# EAGLE design hello_marco (EAGLE 7.2.0)
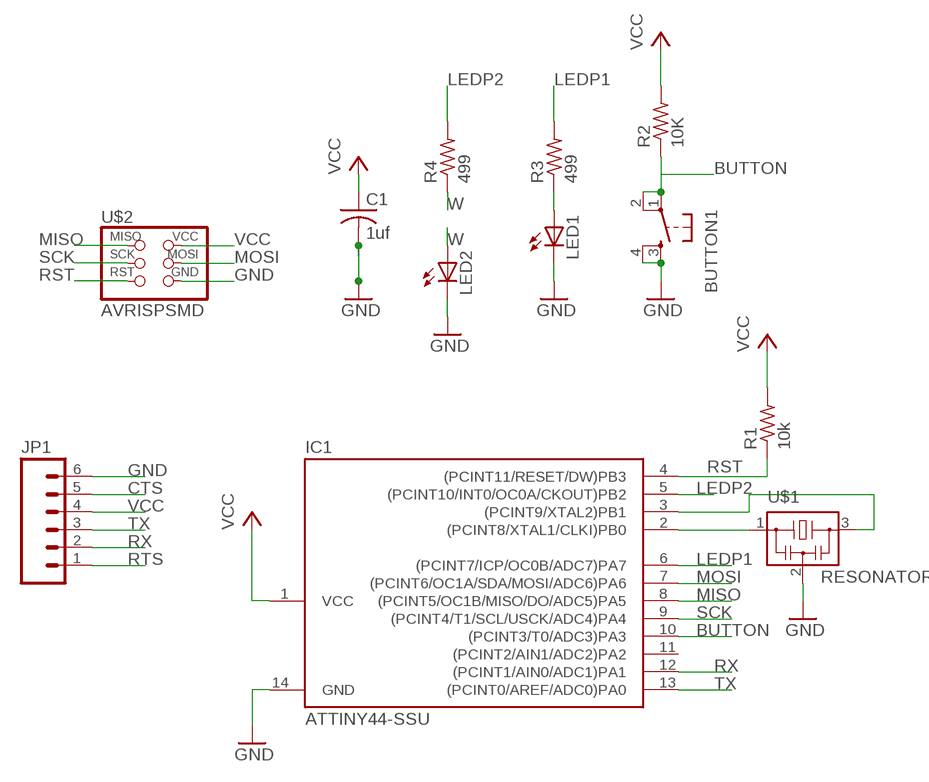
[diagram p0: schematic, sheet 1]

## Parts
BUTTON1  6MM_SWITCH6MM_SWITCH  [6MM_SWITCH]
C1  1uf  C-USC1206  [C1206]
IC1  ATTINY44-SSU  [SOIC14]
JP1  M06SMD  [1X06-SMD]
LED1  LED1206  [1206]
LED2  LED1206  [1206]
R1  10k  R-US_R1206  [R1206]
R2  10K  RESISTOR1206  [1206]
R3  499  RESISTOR1206  [1206]
R4  499  RESISTOR1206  [1206]
U$1  RESONATOR  [EFOBM]
U$2  AVRISPSMD  [2X03SMD]

## Nets
BUTTON: IC1.10((PCINT3/T0/ADC3)PA3)
CTS: JP1.5
GND: BUTTON1.3(S) BUTTON1.4(S1) C1.2 IC1.14(GND) JP1.6 LED1.2(C) LED2.2(C) U$1.2 U$2.6(GND)
LEDP1: IC1.6((PCINT7/ICP/OC0B/ADC7)PA7) R3.2
LEDP2: IC1.5((PCINT10/INT0/OC0A/CKOUT)PB2) R4.2
MISO: IC1.8((PCINT5/OC1B/MISO/DO/ADC5)PA5) U$2.1(MISO)
MOSI: IC1.7((PCINT6/OC1A/SDA/MOSI/ADC6)PA6) U$2.4(MOSI)
N$1: IC1.2((PCINT8/XTAL1/CLKI)PB0) U$1.1
N$2: IC1.3((PCINT9/XTAL2)PB1) U$1.3
N$3: LED1.1(A) R3.1
N$4: BUTTON1.1(P) BUTTON1.2(P1) R2.1
RST: IC1.4((PCINT11/RESET/DW)PB3) R1.1 U$2.5(RST)
RTS: JP1.1
RX: IC1.12((PCINT1/AIN0/ADC1)PA1) JP1.2
SCK: IC1.9((PCINT4/T1/SCL/USCK/ADC4)PA4) U$2.3(SCK)
TX: IC1.13((PCINT0/AREF/ADC0)PA0) JP1.3
VCC: C1.1 IC1.1(VCC) JP1.4 R1.2 R2.2 U$2.2(VCC)
W: LED2.1(A) R4.1
Unconnected: IC1.11((PCINT2/AIN1/ADC2)PA2)

## Library data of the parts
BUTTON1 = 01_FAB_Hello:6MM_SWITCH: OMRON SWITCH
C1 = rcl:C-US: CAPACITOR, American symbol
IC1 = fab:ATTINY44
JP1 = SparkFun:M06: Header 6 Standard 6-pin 0.1" header. Use with straight break away headers (SKU : PRT-00116), right angle break away headers (PRT-00553), swiss pins (PRT-00743), machine pins (PRT-00117), and female headers (PRT-00115). Molex polarized connector foot print use with SKU : PRT-08094 with associated crimp pins and housings. NOTES ON THE VARIANTS LOCK and LOCK_LONGPADS... This footprint was designed to help hold the alignment of a through-hole component (i.e. 6-pin header) while soldering it into place. You may notice that each hole has been shifted either up or down by 0.005 of an inch from it's more standard position (which is a perfectly straight line). This slight alteration caused the pins (the squares in the middle) to touch the edges of the holes. Because they are alternating, it causes a "brace" to hold the component in place. 0.005 has proven to be the perfect amount of "off-center" position when using our standard breakaway headers. Although looks a little odd when you look at the bare footprint, once you have a header in there, the alteration is very hard to notice. Also, if you push a header all the way into place, it is covered up entirely on the bottom side. This idea of altering the position of holes to aid alignment will be further integrated into the Sparkfun Library for other footprints. It can help hold any component with 3 or more connection pins.
LED1 LED2 = 01_FAB_Hello:LED
R1 = resistor:R-US_: RESISTOR, American symbol
R2-R4 = 01_FAB_Hello:RESISTOR
U$1 = fab:RESONATOR
U$2 = fab:AVRISP

## Board
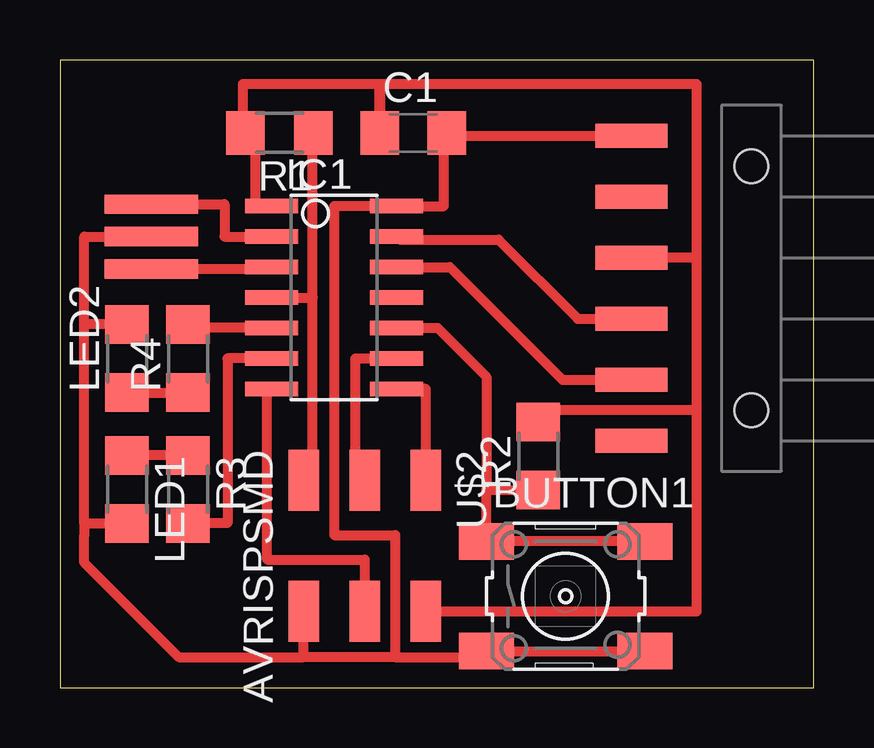
[diagram p1: board, top side]

Size 31.42 x 26.15 mm. Coordinates in mm from the lower left corner, seen from the top.
Outline: 0,0 31.42,0 31.42,26.15 0,26.15 0,0
Copper layers 1: Top 0.035mm
Design rules "ERP-1sided-10mil-16mill": minimum track width 10mil, minimum drill 24mil, track to track 16mil, track to pad 16mil, pad to pad 16mil, via to via 16mil, smd to smd 0mil, copper to edge 16mil, drill to drill 36mil, minimum pad ring 10mil, minimum via ring 8mil, stop-mask expansion 4mil, vias tented up to drill 0mil, thermal gap 10mil

### Footprints (pad centres in the part's own frame; a part is rotated, then mirrored left to right if it is on the bottom)
6MM_SWITCH = smd 2.286 x 1.524: 1 -3.302,2.286; 2 3.302,2.286; 3 -3.302,-2.286; 4 3.302,-2.286
C1206 = smd 1.6 x 1.8: 1 -1.4,0; 2 1.4,0
SOIC14 = smd 0.61 x 2.21: 1 -3.81,-2.603; 2 -2.54,-2.603; 3 -1.27,-2.603; 4 0,-2.603; 5 1.27,-2.603; 6 2.54,-2.603; 7 3.81,-2.603; 8 3.81,2.603; 9 2.54,2.603; 10 1.27,2.603; 11 0,2.603; 12 -1.27,2.603; 13 -2.54,2.603; 14 -3.81,2.603
1X06-SMD = smd 1 x 3: 1 -6.35,5; 2 -3.81,5; 3 -1.27,5; 4 1.27,5; 5 3.81,5; 6 6.35,5 | hole 1.4: -5.08,0; 5.08,0
1206 = smd 1.6 x 1.803: 1 -1.422,0; 2 1.422,0
R1206 = smd 1.6 x 1.803: 1 -1.422,0; 2 1.422,0
EFOBM = smd 0.8 x 3.9: 1 -1.35,0; 2 0,0; 3 1.35,0
2X03SMD = smd 2.54 x 1.27: 1 -2.54,2.54; 2 2.92,2.54; 3 -2.54,0; 4 2.92,0; 5 -2.54,-2.54; 6 2.92,-2.54

### Placement (x,y rotation side)
BUTTON1  21.08,3.81 0 top
C1  14.73,23.11 0 top
IC1  11.43,16.26 270 top
JP1  28.83,16.64 90 top
LED1  2.79,8.26 270 top
LED2  2.79,13.72 90 top
R1  9.14,23.11 180 top
R2  19.94,9.65 90 top
R3  5.33,8.26 270 top
R4  5.33,13.72 90 top
U$1  3.81,18.8 270 top
U$2  12.7,6.1 270 top

### Tracks (layer width: path | path; a pad name or v marks a point on that pad's centre or on a via)
BUTTON
  Top 0.406: IC1.10 15.75,14.99 17.78,12.95 17.78,8.26
GND
  Top 0.406: JP1.6 16.13,22.99 C1.2 16,23.11 16,20.07 IC1.14 11.43,20.07 11.43,6.35 13.97,6.35 13.97,1.27 | U$2.6 10.16,1.27 | 13.97,1.27 17.78,1.27 BUTTON1.3 BUTTON1.4 | 1.02,6.83 1.02,15.14 | 1.02,15.14 1.02,18.8 U$1.2 | 13.97,1.27 10.16,1.27 | LED2.2 1.02,15.14 | 10.16,1.27 4.95,1.27 1.02,5.21 1.02,6.35 1.02,6.83 | LED1.2 1.02,6.83
LEDP1
  Top 0.406: IC1.6 6.99,13.72 6.99,6.86 5.33,6.86 R3.2
LEDP2
  Top 0.406: IC1.5 5.33,14.99 R4.2
MISO
  Top 0.406: IC1.8 15.24,12.45 U$2.1
MOSI
  Top 0.406: IC1.7 8.64,12.45 8.64,5.33 12.7,5.33 U$2.4
N$1
  Top 0.406: U$1.1 6.86,20.15 6.86,18.8 IC1.2
N$2
  Top 0.406: U$1.3 8.83,17.45 IC1.3
N$3
  Top 0.406: R3.1 LED1.1
N$4
  Top 0.406: R2.1 17.78,8.26 BUTTON1.1 BUTTON1.2
RST
  Top 0.406: R1.1 10.54,23.11 10.54,16.26 | IC1.4 10.54,16.26 | U$2.5 10.54,8.64 10.54,16.26
RX
  Top 0.406: IC1.12 16.26,17.53 20.95,12.83 JP1.2
SCK
  Top 0.406: U$2.3 12.32,8.64 12.32,13.72 IC1.9
TX
  Top 0.406: IC1.13 14.16,18.67 18.29,18.67 21.59,15.37 JP1.3
VCC
  Top 0.406: 26.54,17.91 JP1.4 | 26.54,11.56 26.54,17.91 | IC1.1 8.13,20.07 8.13,23.11 R1.2 7.62,23.11 7.62,25.15 13.33,25.15 C1.1 13.34,25.15 26.54,25.15 26.54,17.91 | 26.54,11.56 19.94,11.56 R2.2 | U$2.2 26.54,3.18 26.54,11.56
W
  Top 0.406: LED2.1 R4.1